# EAGLE design Adafruit TPL5110 (EAGLE 6.6.0)
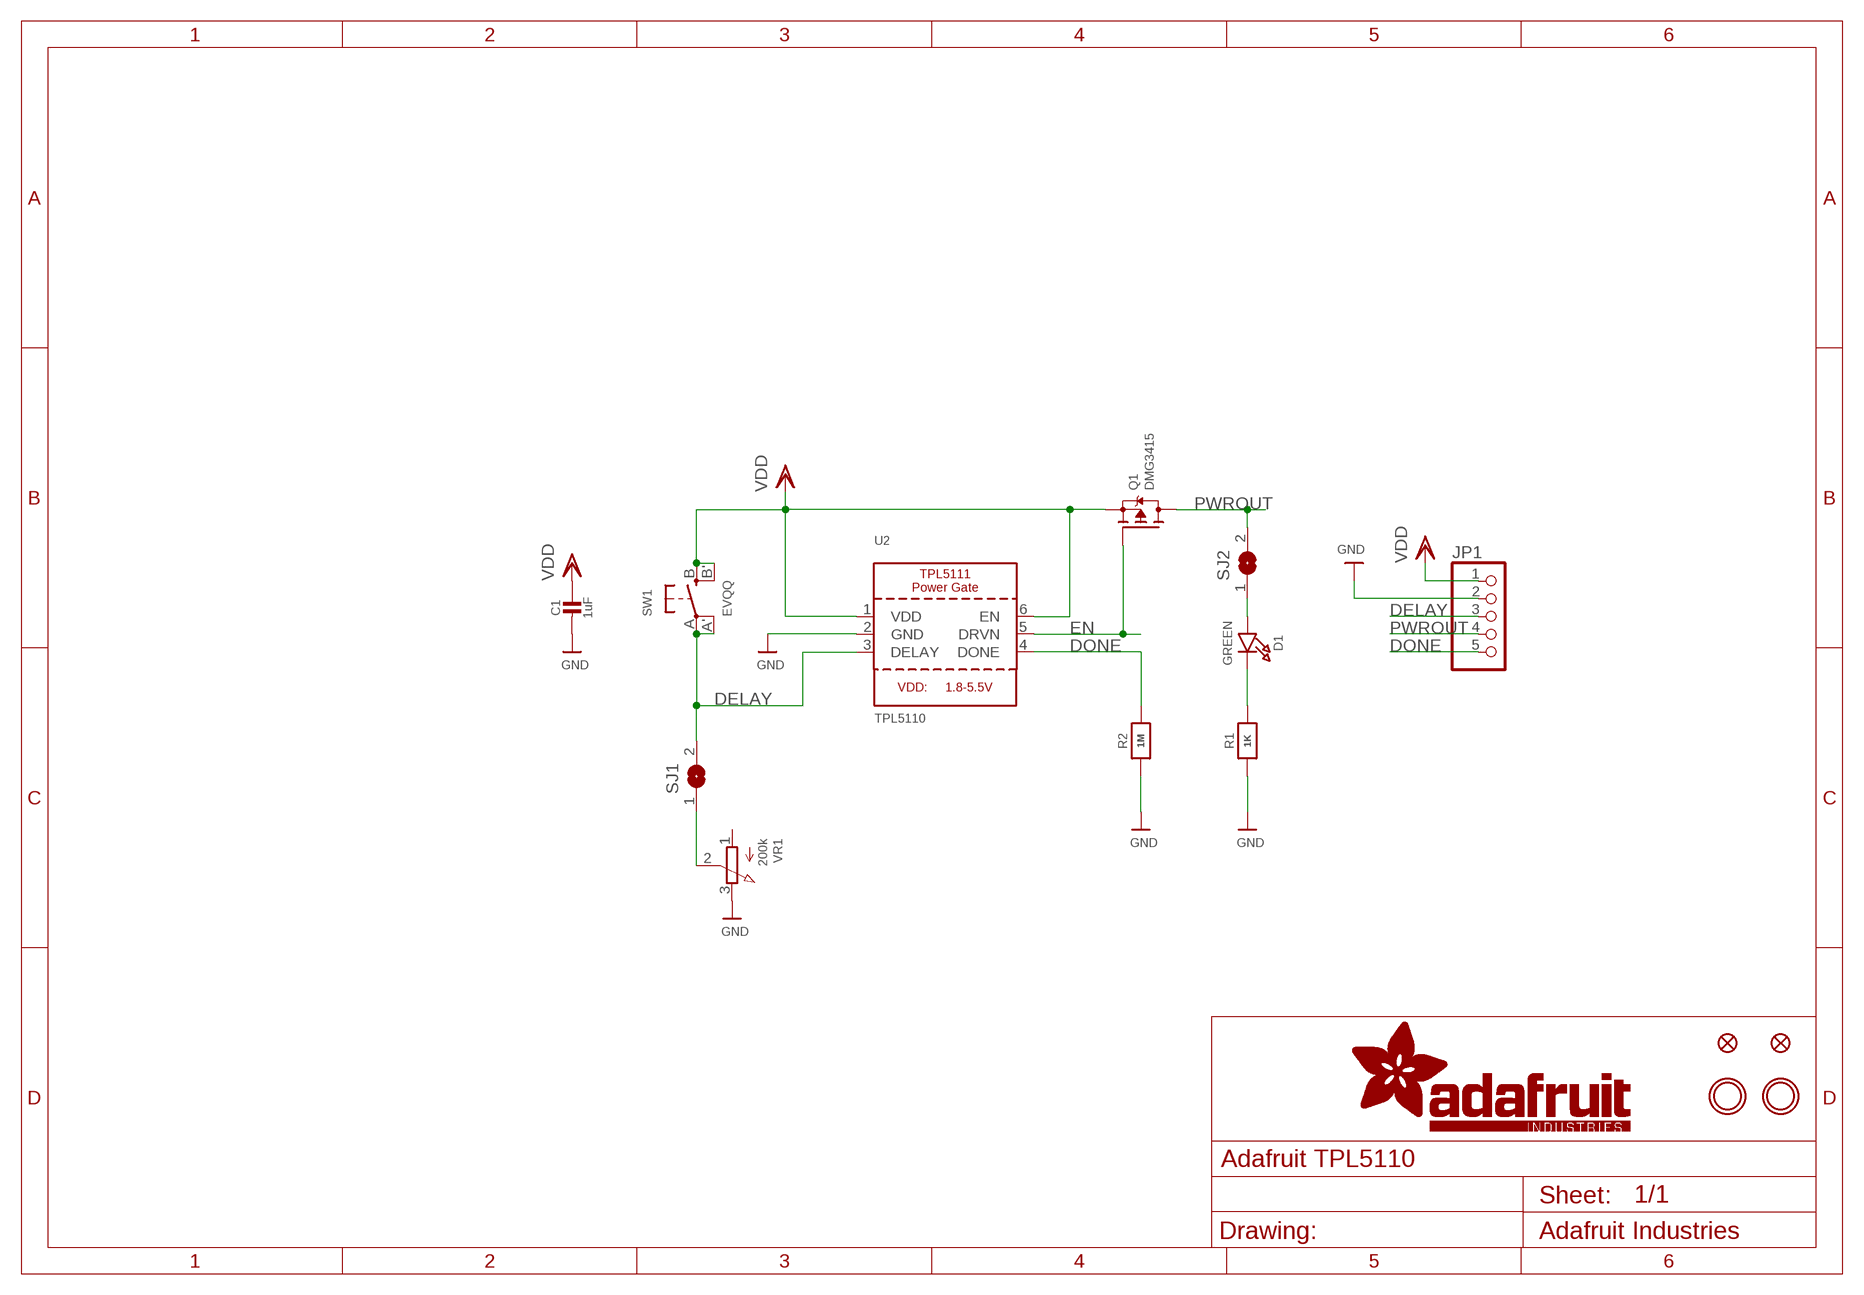
[diagram p0: schematic, sheet 1]

## Parts
C1  1uF  CAP_CERAMIC0805-NOOUTLINE  [0805-NO]
D1  GREEN  LED0805_NOOUTLINE  [CHIPLED_0805_NOOUTLINE]
FID1  FIDUCIAL""  [FIDUCIAL_1MM]
FID2  FIDUCIAL""  [FIDUCIAL_1MM]
JP1  HEADER-1X570MIL  [1X05_ROUND_70]
Q1  DMG3415  MOSFET-PWIDE  [SOT23-WIDE]
R1  1K  RESISTOR0805_NOOUTLINE  [0805-NO]
R2  1M  RESISTOR0805_NOOUTLINE  [0805-NO]
SJ1  SOLDERJUMPERCLOSED  [SOLDERJUMPER_CLOSEDWIRE]
SJ2  SOLDERJUMPERCLOSED  [SOLDERJUMPER_CLOSEDWIRE]
SW1  EVQQ  SWITCH_TACT_SMT_EVQQ2_SMALL  [EVQ-Q2_SMALLER]
U2  TPL5110  TPL5111  [SOT23-6]
U$7  MOUNTINGHOLE2.5  [MOUNTINGHOLE_2.5_PLATED]
U$8  MOUNTINGHOLE2.5  [MOUNTINGHOLE_2.5_PLATED]
VR1  200k  TRIMPOTTC33X-2  [TRIMPOT_BOURNS_TC33X-2]

## Nets
DELAY: JP1.3 SJ1.2 SW1.A'(P1) SW1.A(P) U2.3(DELAY)
DONE: JP1.5 R2.2 U2.4(DONE)
EN: Q1.1(G) U2.5(DRVN)
GND: C1.2 JP1.2 R1.1 R2.1 U2.2(GND) VR1.3(E)
N$1: SJ1.1 VR1.2(S)
N$2: D1.A SJ2.1
N$3: D1.C R1.2
PWROUT: JP1.4 Q1.3(D) SJ2.2
VDD: C1.1 JP1.1 Q1.2(S) SW1.B'(S1) SW1.B(S) U2.1(VDD) U2.6(EN)
Unconnected: VR1.1(A)

## Library data of the parts
C1 = microbuilder:CAP_CERAMIC: Ceramic Capacitors For new designs, use the packages preceded by an '_' character since they are more reliable: The following footprints should be used on most boards: _0402 - Standard footprint for regular board layouts _0603 - Standard footprint for regular board layouts _0805 - Standard footprint for regular board layouts _1206 - Standard footprint for regular board layouts For extremely tight-pitch boards where space is at a premium, the following 'micro-pitch' footprints can be used (smaller pads, no silkscreen outline, etc.): _0402MP - Micro-pitch footprint for very dense/compact boards _0603MP - Micro-pitch footprint for very dense/compact boards _0805MP - Micro-pitch footprint for very dense/compact boards _1206MP - Micro-pitch footprint for very dense/compact boards
D1 = microbuilder:LED: LED 0603 - 0603 Surface Mount Package 2mA: Green LED - Low Power (3.9mcd, 2ma, 1.7Vf) - Digikey: 475-2709-2-ND Orange LED - Low Power (9.8mcd, 2ma, 1.8Vf) - Digikey: 475-1194-2-ND Red LED - Low Power (5mcd, 2ma, 1.8Vf) - Digikey: 475-1195-2-ND Yellow LED - Low Power (7mcd, 2ma, 1.8Vf) - Digikey: 475-1196-2-ND 5mA: Blue LED - Low Power (17mcd, 5ma, 2.9Vf) - Digikey: LNJ937W8CRACT-ND 0805 - 0805 Surface Mount Package 2mA: Red LED (8.8mcd, 2mA, 1.8Vf, Clear) - Low Power [Digikey: 475-2510-1-ND] Green LED (5mcd, 2mA, 1.8Vf, Clear) - Low Power [Digikey: 475-2730-1-ND] Yellow LED (11.3mcd, 2mA, 1.8Vf, Clear) - Low Power [Digikey: 475-2555-1-ND] 20mA: Red LED (104mcd, 20mA, Diffused) - LS R976 [Digikey: 475-1278-6-ND] Red LED (12mcd, 20mA, 2.0Vf, Clear) - APT2012EC [Digikey: 754-1128-1-ND] Green LED (15mcd, 20mA, 2.2Vf, Clear) - APT2012GC [Digikey: 754-1131-1-ND] Orange LED (160mcd, 20mA, 2.1Vf, Clear) - APT2012SECK [Digikey: 754-1130-1-ND] 1206 - 1206 Surface Mount Package Green LED (26mcd, 20mA, Diffused) - LG N971 [Digikey: 475-1407-6-ND] Red LED (15mcd, 20mA, Diffused) - LH N974 [Digikey: 475-1416-6-ND] Cree - Cree High-Power Surface Mount LEDs XPEBWT-L1-0000-00D50 - White 111lm 350mA 2.9Vf 6200K 110° XTEAWT-00-0000-00000LEE3 - White 114lm 350mA 2.85Vf 5000K 115° Everlight - Everlight 45-21 Series Surface Mount LEDs 45-21/QK2C-B2832AC2CB2/2T - Warm White 2000mcd 20mA 3.25Vf 3050K 120° 45-21/LK2C-B38452C4CB2/2T - Nuetral White 2000mcd 20mA 3.25Vf 4150K 120° 45-21/LK2C-B50634C6CB2/2T - Cold White 2200mcd 20mA 3.25Vf 5650K 120° PLCC2 Reverse Mount LS T77K-J1L2-1-0-2-R18-Z - Red 11.25mcd 2mA 1.8Vf 630nm 120° LO T77K-L1M2-24-Z - Orange 19.6mcd 2mA 1.8Vf 606nm 120° LY T77K-K2M1-26-Z - Yellow 15.7mcd 2mA 1.8Vf 587nm 120°
FID1 FID2 = microbuilder:FIDUCIAL: Fiducial Alignment Points Various fiducial points for machine vision alignment.; BOM: EXCLUDE
JP1 = microbuilder:HEADER-1X5: PIN HEADER
Q1 = microbuilder:MOSFET-P: P-Channel Mosfet LEGEND VDS: Voltage Drain-Source ID: Drain Current RDS(ON): Drain-Source On-State Resistance VGS(TH): Gate-Source Threshold Voltage CISS: Drain-Source Input Capacitance SOT-23 Name VDS ID RDS(ON) VGS(TH) CISS Order Number IRLML5103 30V 760mA 600 mOhm -- 75pF @ 25V Digikey: IRLML5103PBFCT-ND IRLML6401 12V 4.3A 50 mOhm 950mV @ 250µA 830pF @ 10V Digikey: IRLML6401PBFTR-ND NTR0202PL 20V 400mA 800 mOhm 2.3V @ 250uA 70pF @ 5V Digikey: NTR0202PLT1GOSTR-ND NTR4101PT1G 20V 1.8A 85 mOhm 1.2V @ 250uA 675pF @ 10V Digikey: NTR4101PT1GOSCT-ND DMP2004K 20V 600mA 900 mOhm 1V @ 250uA 175pF @ 16V Digikey: DMP2004KDICT-ND PMV65XP 20V 3.9A 76 mOhm 950mV @ 1mA 725pF @ 20V Digikey: 568-2358-2-ND TO-252 Name VDS ID RDS(ON) VGS(TH) CISS Order Number AOD417 30V 25A 34 mOhm 3V @ 250µA 920pF @ 15V Digikey: 785-1106-2-ND
R1 R2 = microbuilder:RESISTOR: Resistors For new designs, use the packages preceded by an '_' character since they are more reliable: The following footprints should be used on most boards: _0402 - Standard footprint for regular board layouts _0603 - Standard footprint for regular board layouts _0805 - Standard footprint for regular board layouts _1206 - Standard footprint for regular board layouts For extremely tight-pitch boards where space is at a premium, the following 'micro-pitch' footprints can be used (smaller pads, no silkscreen outline, etc.): _0402MP - Micro-pitch footprint for very dense/compact boards _0603MP - Micro-pitch footprint for very dense/compact boards _0805MP - Micro-pitch footprint for very dense/compact boards _1206MP - Micro-pitch footprint for very dense/compact boards
SJ1 SJ2 = microbuilder:SOLDERJUMPER: SMD Solder JUMPER Solder the two pads together to create a connection, or remove the solder to break it. REFLOW - Use this footprint for solder paste and reflow ovens. WAVE - Use this footprint for hand-soldering (larger pads). CLOSED - Has a trace between the two pads to ensure it is closed by default. The trace needs to be cut to disable the jumper, and can be closed again by creating a solder bridge between the two pads.
SW1 = microbuilder:SWITCH_TACT_SMT: SMT Tact Switches 6x6mm - Digikey: P12940SCT-ND KMR2 (4.6x2.8mm) - Digikey: 401-1426-1-ND EVQ-PQHB55 - Light Touch, 160GF (4.5x4.5mm) - Digikey: P8090SCT-ND KMT0 - KMT021 NGJ LHS (etc.) IP68/Waterproof - Digikey: CKN10289CT-ND
U2 = microbuilder:TPL5111: TPL5111 Timer Based Power Gate Selectable Time Intervals: 100 ms to 7200 s Current Consumption at 2.5 V: 35 nA (typical) Supply Voltage Range: 1.8 V to 5.5 V
U$7 U$8 = microbuilder:MOUNTINGHOLE: Mounting Hole For #2 screws (0.086"/2.18mm width, 0.094"/2.4mm hole) use 2.5mm
VR1 = microbuilder:TRIMPOT: 3-Pin SMT Trimpots Bourns TC33 (X-2) Series 1K - Digikey: TC33X-102ECT-ND 10K - Digikey: TC33X-2-103E 100K - Digikey: TC33X-104ECT-ND Bourns 3303 (W) Series 3mm 10K Single Turn - Digikey: 3303W-103ETR-ND 3mm 100K Single Turn - Digikey: 3303X-104ETR-ND

## Board
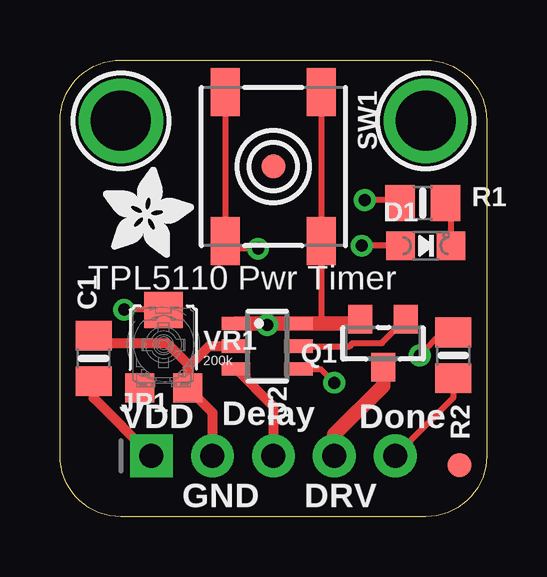
[diagram p1: board, top side]
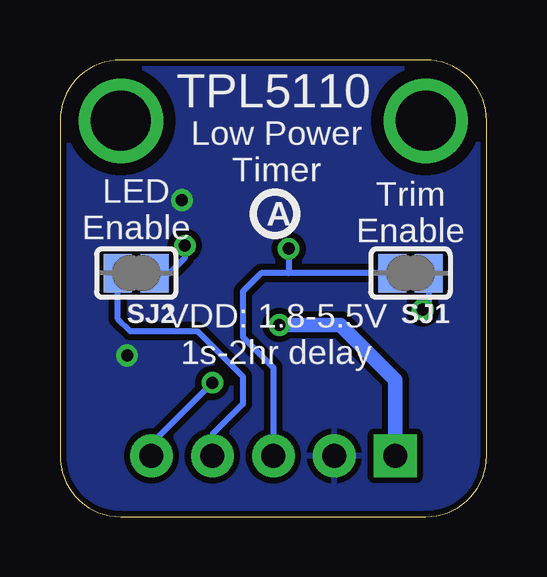
[diagram p2: board, bottom side, seen from below]

Size 17.78 x 19.05 mm. Coordinates in mm from the lower left corner, seen from the top.
Outline: 2.54,19.05 15.24,19.05 arc-90 17.78,16.51 17.78,2.54 arc-90 15.24,0 2.54,0 arc-90 0,2.54 0,16.51 arc-90 2.54,19.05
Copper layers (1*16): Top 0.035mm / dielectric 1.5mm / Bottom 0.035mm
Design rules "adafruit *": minimum track width 8mil, minimum drill 15.5mil, track to track 8mil, track to pad 8mil, pad to pad 8mil, via to via 8mil, smd to smd 8mil, copper to edge 10mil, drill to drill 8mil, minimum pad ring 10mil, minimum via ring 8mil, stop-mask expansion 2mil, vias tented up to drill 20mil, thermal gap 10mil

### Footprints (pad centres in the part's own frame; a part is rotated, then mirrored left to right if it is on the bottom)
0805-NO = smd 1.24 x 1.5: 1 -0.95,0; 2 0.95,0
CHIPLED_0805_NOOUTLINE = smd 1.2 x 1.2: A 0,-1.05; C 0,1.05
FIDUCIAL_1MM = smd 1 x 1: 1 0,0
1X05_ROUND_70 = drill 1 pad 1.778 square: 1 -5.08,0 | drill 1 pad 1.778: 2 -2.54,0; 3 0,0; 4 2.54,0; 5 5.08,0
SOT23-WIDE = smd 1 x 1.2: 1 -0.95,-1; 2 0.95,-1; 3 0,1
SOLDERJUMPER_CLOSEDWIRE = smd 1.168 x 1.6: 1 -0.762,0; 2 0.762,0 | smd 0.635 x 0.203: WIRE 0,0
EVQ-Q2_SMALLER = smd 2 x 1.2: A -3.1,-2; A' 3.1,-2; B -3.1,2; B' 3.1,2
SOT23-6 = smd 0.55 x 1.2: 1 -0.95,-1.3; 2 0,-1.3; 3 0.95,-1.3; 4 0.95,1.3; 5 0,1.3; 6 -0.95,1.3
MOUNTINGHOLE_2.5_PLATED = drill 2.5 pad 3.2: P$1 0,0
TRIMPOT_BOURNS_TC33X-2 = smd 1.2 x 1.2: 1 -1,-1.8; 3 1,-1.8 | smd 1.6 x 1.5: 2 0,1.45

### Placement (x,y rotation side)
C1  1.4,6.6 90 top
D1  15.24,11.3 270 top
FID1  8.89,14.61 0 top
FID2  16.64,2.16 0 top
JP1  8.89,2.54 0 top
Q1  13.46,7.24 180 top
R1  15.11,13.08 0 top
R2  16.38,6.73 270 top
SJ1  3.17,10.16 180 bottom
SJ2  14.61,10.16 180 bottom
SW1  8.89,14.61 270 top
U2  8.64,7.11 270 top
U$5  [ADAFRUIT_3.5MM]  1.78,10.79 0 top
U$7  15.24,16.51 0 top
U$8  2.54,16.51 0 top
U$11  [PCBFEAT-REV-040]  8.83,12.64 0 bottom
VR1  4.32,7.18 0 top

### Tracks (layer width: path | path; a pad name or v marks a point on that pad's centre or on a via)
DELAY  (via drill 0.5)
  Top 0.254: SW1.A 6.89,12.06 | 6.89,12.06 SW1.A' 6.89,11.18 v8.25,11.18 | 7.02,12.19 6.89,12.06
  Top 0.406: U2.3 8.89,4.61 JP1.3
  Bottom 0.254: SJ1.2 8.25,10.16 | JP1.3 8.89,6.22 10.16,7.49 10.16,9.4 9.4,10.16 8.25,10.16 | v8.25,11.18 8.25,10.16
DONE  (via drill 0.5)
  Top 0.254: U2.4 10.86,6.16 v11.43,5.59 | R2.2 16.38,4.95 JP1.5
  Bottom 0.254: v11.43,5.59 13.97,3.05 JP1.5
EN
  Top 0.254: U2.5 12.07,7.11 12.19,7.24 13.41,7.24 Q1.1
GND  (via drill 0.5)
  Top 0.254: R1.1 14.04,13.21 v12.7,13.21 | R2.1 15.94,7.68 v14.99,6.73
  Top 0.406: C1.2 1.71,7.24 4.45,7.24 5.32,6.37 5.32,6.22 | 5.32,6.22 VR1.3 6.35,4.34 JP1.2 | U2.2 6.21,7.11 5.32,6.22
  Bottom 0.254: v14.99,6.73 14.99,6.48
  pour Bottom (isolate 0.254): 0,0 0,19.07 17.78,19.07 17.91,-0.13
N$1  (via drill 0.5)
  Top 0.254: VR1.2 4.32,8.64 v2.67,8.64
  Bottom 0.254: SJ1.1 2.41,8.89 v2.67,8.64
N$2  (via drill 0.5)
  Top 0.254: D1.A v12.57,11.3
  Bottom 0.254: v12.57,11.3 12.57,10.79 13.21,10.16 SJ2.1
N$3
  Top 0.254: R1.2 16.29,13.08 D1.C
PWROUT
  Top 0.61: Q1.3 13.46,5.46 11.43,3.43 JP1.4
  Bottom 0.254: JP1.4 11.43,3.43 10.16,4.7 10.16,5.84 12.07,7.75 14.86,7.75 15.37,8.25 SJ2.2
VDD  (via drill 0.5)
  Top 0.254: SW1.B SW1.B' 10.89,8.09 10.92,8.06
  Top 0.406: 12.34,8.06 Q1.2 | C1.1 1.4,4.95 JP1.1
  Top 0.61: 8.64,8.06 U2.6 10.92,8.06 12.34,8.06 | 8.64,8.06 U2.1 | 8.64,8.06 v8.64,8
  Bottom 0.61: v8.64,8 6.1,8 3.81,5.71 JP1.1

### Text on the board
tPlace: TPL5110 Pwr Timer | VDD | Delay | Done | GND | DRV
bPlace: TPL5110 | Low Power / Timer | Trim / Enable | LED / Enable | VDD: 1.8-5.5V / 1s-2hr delay